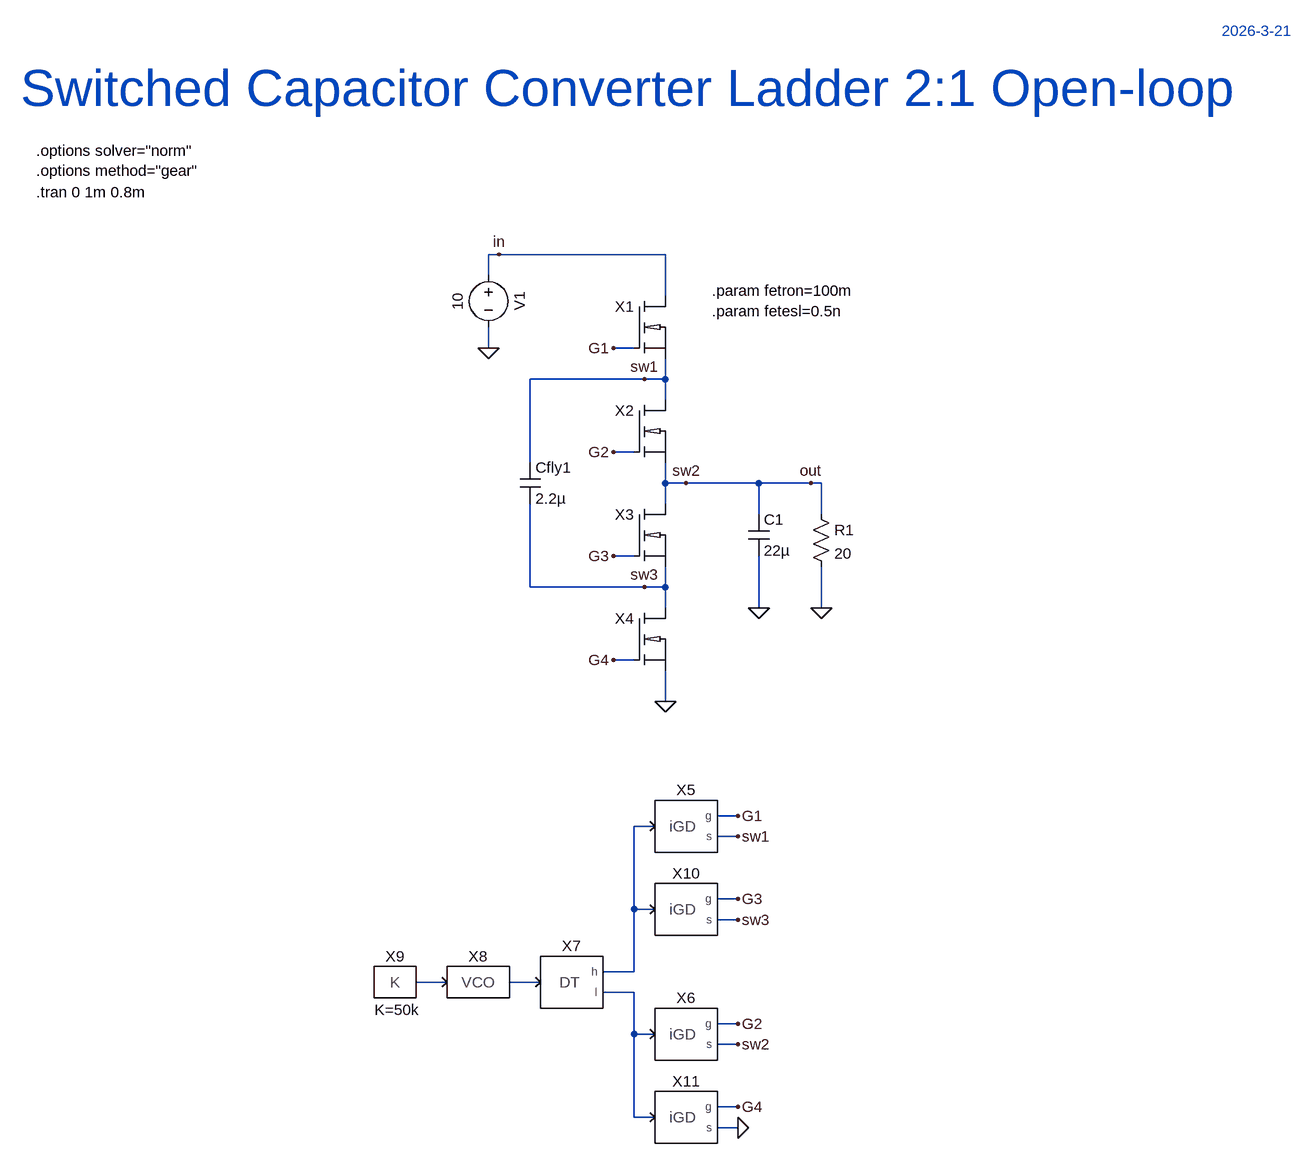
[diagram p0: schematic SCC_Ladder_2to1_openloop.asc]
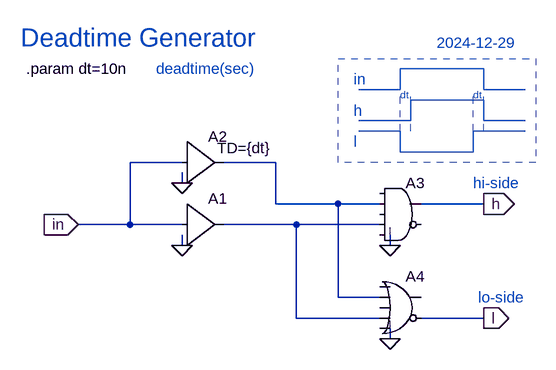
[diagram p1: sub-circuit deadtime.asc]
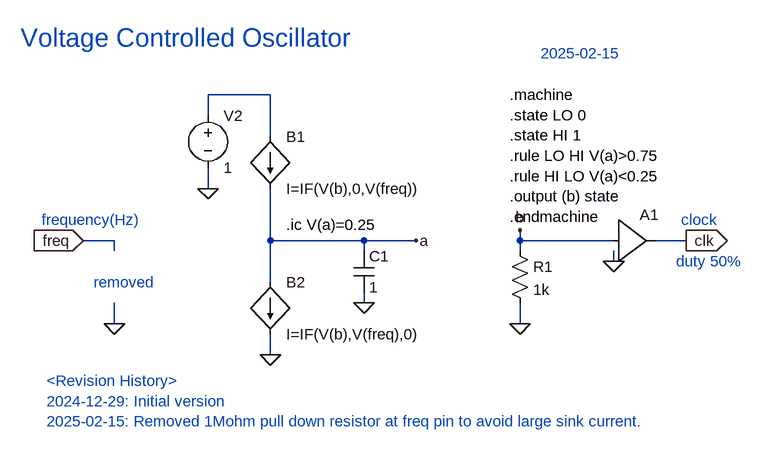
[diagram p2: sub-circuit vco.asc]
SCC_Ladder_2to1_openloop.asc, the LTspice schematic file:
Version 4.1
SHEET 1 2724 2028
WIRE 176 592 160 592
WIRE 432 592 176 592
WIRE 160 624 160 592
WIRE 432 656 432 592
WIRE 160 736 160 704
WIRE 384 736 352 736
WIRE 400 784 224 784
WIRE 432 784 432 752
WIRE 432 784 400 784
WIRE 432 816 432 784
WIRE 384 896 352 896
WIRE 224 912 224 784
WIRE 432 944 432 912
WIRE 464 944 432 944
WIRE 576 944 464 944
WIRE 656 944 576 944
WIRE 672 944 656 944
WIRE 432 976 432 944
WIRE 576 992 576 944
WIRE 672 992 672 944
WIRE 384 1056 352 1056
WIRE 224 1104 224 976
WIRE 400 1104 224 1104
WIRE 432 1104 432 1072
WIRE 432 1104 400 1104
WIRE 432 1136 432 1104
WIRE 576 1136 576 1056
WIRE 672 1136 672 1072
WIRE 384 1216 352 1216
WIRE 432 1280 432 1232
WIRE 544 1456 512 1456
WIRE 416 1472 384 1472
WIRE 544 1488 512 1488
WIRE 544 1584 512 1584
WIRE 384 1600 384 1472
WIRE 416 1600 384 1600
WIRE 544 1616 512 1616
WIRE 384 1696 384 1600
WIRE 384 1696 336 1696
WIRE 96 1712 48 1712
WIRE 240 1712 192 1712
WIRE 384 1728 336 1728
WIRE 544 1776 512 1776
WIRE 384 1792 384 1728
WIRE 416 1792 384 1792
WIRE 544 1808 512 1808
WIRE 544 1904 512 1904
WIRE 384 1920 384 1792
WIRE 416 1920 384 1920
WIRE 544 1936 512 1936
FLAG 576 1136 0
FLAG 656 944 out
FLAG 176 592 in
FLAG 464 944 sw2
FLAG 672 1136 0
FLAG 432 1280 0
FLAG 352 736 G1
FLAG 352 896 G2
FLAG 352 1056 G3
FLAG 352 1216 G4
FLAG 400 784 sw1
FLAG 400 1104 sw3
FLAG 544 1456 G1
FLAG 544 1488 sw1
FLAG 544 1776 G2
FLAG 544 1584 G3
FLAG 544 1616 sw3
FLAG 544 1904 G4
FLAG 544 1936 0
FLAG 544 1808 sw2
FLAG 160 736 0
SYMBOL voltage 160 608 R0
WINDOW 0 32 56 VTop 2
WINDOW 3 -32 56 VBottom 2
WINDOW 123 0 0 Left 0
WINDOW 39 0 0 Left 0
SYMATTR InstName V1
SYMATTR Value 10
SYMBOL cap 560 992 R0
SYMATTR InstName C1
SYMATTR Value 22µ
SYMATTR SpiceLine Rser=3m Lser=0.9n
SYMBOL res 656 976 R0
SYMATTR InstName R1
SYMATTR Value 20
SYMBOL iNMOS 432 864 R0
SYMATTR InstName X2
SYMATTR Value esl={fetesl} rsnb=1k csnb=10p
SYMATTR SpiceLine ron={fetron}
SYMBOL iNMOS 432 1024 R0
SYMATTR InstName X3
SYMATTR Value esl={fetesl} rsnb=1k csnb=10p
SYMATTR SpiceLine ron={fetron}
SYMBOL iNMOS 432 704 R0
SYMATTR InstName X1
SYMATTR Value esl={fetesl} rsnb=1k csnb=10p
SYMATTR SpiceLine ron={fetron}
SYMBOL iNMOS 432 1184 R0
SYMATTR InstName X4
SYMATTR Value esl={fetesl} rsnb=1k csnb=10p
SYMATTR SpiceLine ron={fetron}
SYMBOL cap 208 912 R0
SYMATTR InstName Cfly1
SYMATTR Value 2.2µ
SYMATTR SpiceLine Rser=5m Lser=0.7n
SYMBOL iGD 464 1472 R0
SYMATTR InstName X5
SYMBOL iGD 464 1792 R0
SYMATTR InstName X6
SYMBOL DEADTIME 288 1712 R0
SYMATTR InstName X7
SYMBOL PowerSim\\VCO 144 1712 R0
SYMATTR InstName X8
SYMBOL PowerSim\\CONST 16 1712 R0
WINDOW 39 3 58 Bottom 2
SYMATTR SpiceLine K=50k
SYMATTR InstName X9
SYMBOL iGD 464 1600 R0
SYMATTR InstName X10
SYMBOL iGD 464 1920 R0
SYMATTR InstName X11
TEXT -536 496 Left 2 !.tran 0 1m 0.8m
TEXT -560 336 Left 6 ;Switched Capacitor Converter Ladder 2:1 Open-loop
TEXT 1288 248 Left 2 ;2026-3-21
TEXT -536 432 Left 2 !.options solver="norm"\n.options method="gear"
TEXT 504 648 Left 2 !.param fetron=100m\n.param fetesl=0.5n

deadtime.asc, the sub-circuit schematic file:
Version 4
SHEET 1 1412 1312
WIRE 64 288 -16 288
WIRE 208 288 128 288
WIRE 64 320 64 304
WIRE 208 352 208 288
WIRE 304 352 208 352
WIRE 368 352 304 352
WIRE 528 352 432 352
WIRE -16 384 -16 288
WIRE -16 384 -96 384
WIRE 64 384 -16 384
WIRE 240 384 128 384
WIRE 368 384 240 384
WIRE 64 416 64 400
WIRE 384 416 384 400
WIRE 304 496 304 352
WIRE 368 496 304 496
WIRE 240 528 240 384
WIRE 368 528 240 528
WIRE 528 528 432 528
WIRE 384 560 384 544
FLAG -96 384 in
IOPIN -96 384 In
FLAG 64 416 0
FLAG 64 320 0
FLAG 384 416 0
FLAG 384 560 0
FLAG 528 352 h
IOPIN 528 352 Out
FLAG 528 528 l
IOPIN 528 528 Out
SYMBOL Digital\\buf1 64 320 R0
SYMATTR InstName A1
SYMBOL Digital\\buf1 64 224 R0
WINDOW 3 54 42 Left 2
SYMATTR Value TD={dt}
SYMATTR InstName A2
SYMBOL Digital\\and 400 304 R0
SYMATTR InstName A3
SYMBOL Digital\\or 400 448 R0
SYMATTR InstName A4
TEXT -176 144 Left 2 !.param dt=10n
TEXT -184 96 Left 4 ;Deadtime Generator
TEXT 24 144 Left 2 ;deadtime(sec)
TEXT 512 320 Left 2 ;hi-side
TEXT 520 496 Left 2 ;lo-side
TEXT 328 160 Left 2 ;in
TEXT 328 208 Left 2 ;h
TEXT 328 256 Left 2 ;l
TEXT 400 184 Left 1 ;dt
TEXT 512 184 Left 1 ;dt
TEXT 456 104 Left 2 ;2024-12-29
LINE Normal 400 176 336 176
LINE Normal 400 176 400 144
LINE Normal 528 144 400 144
LINE Normal 528 176 528 144
LINE Normal 592 176 528 176
LINE Normal 416 224 336 224
LINE Normal 416 224 416 192
LINE Normal 528 192 416 192
LINE Normal 528 224 528 192
LINE Normal 592 224 528 224
LINE Normal 400 240 336 240
LINE Normal 400 272 400 240
LINE Normal 512 272 400 272
LINE Normal 512 272 512 240
LINE Normal 592 240 512 240
LINE Normal 400 240 400 176 2
LINE Normal 512 240 512 176 2
LINE Normal 416 240 416 176 2
LINE Normal 528 240 528 176 2
RECTANGLE Normal 608 288 304 128 2

vco.asc, the sub-circuit schematic file:
Version 4
SHEET 1 1132 680
WIRE 176 -176 80 -176
WIRE 80 -144 80 -176
WIRE 176 -112 176 -176
WIRE 80 -32 80 -64
WIRE -64 48 -112 48
WIRE 176 48 176 -32
WIRE 320 48 176 48
WIRE 400 48 320 48
WIRE 560 48 560 32
WIRE 704 48 560 48
WIRE 816 48 768 48
WIRE -64 64 -64 48
WIRE 320 64 320 48
WIRE 560 64 560 48
WIRE 704 80 704 64
WIRE 176 112 176 48
WIRE 320 144 320 128
WIRE -64 176 -64 144
WIRE 560 176 560 144
WIRE 176 224 176 192
FLAG 320 144 0
FLAG 560 176 0
FLAG 176 224 0
FLAG 80 -32 0
FLAG 400 48 a
FLAG 560 32 b
FLAG 704 80 0
FLAG 816 48 clk
IOPIN 816 48 Out
FLAG -112 48 freq
IOPIN -112 48 In
FLAG -64 176 0
SYMBOL cap 304 64 R0
SYMATTR InstName C1
SYMATTR Value 1
SYMBOL res 544 48 R0
SYMATTR InstName R1
SYMATTR Value 1k
SYMBOL voltage 80 -160 R0
WINDOW 123 0 0 Left 0
WINDOW 39 0 0 Left 0
SYMATTR InstName V2
SYMATTR Value 1
SYMBOL bi 176 112 R0
SYMATTR InstName B2
SYMATTR Value I=IF(V(b),V(freq),0)
SYMBOL bi 176 -112 R0
SYMATTR InstName B1
SYMATTR Value I=IF(V(b),0,V(freq))
SYMBOL Digital\\buf1 704 -16 R0
SYMATTR InstName A1
TEXT 544 -176 Left 2 !.machine\n.state LO 0\n.state HI 1\n.rule LO HI V(a)>0.75\n.rule HI LO V(a)<0.25\n.output (b) state\n.endmachine
TEXT 200 24 Left 2 !.ic V(a)=0.25
TEXT -208 -264 Left 4 ;Voltage Controlled Oscillator
TEXT -176 16 Left 2 ;frequency(Hz)
TEXT 808 16 Left 2 ;clock
TEXT 800 80 Left 2 ;duty 50%
TEXT 592 -240 Left 2 ;2025-02-15
TEXT -168 264 Left 2 ;<Revision History>\n2024-12-29: Initial version\n2025-02-15: Removed 1Mohm pull down resistor at freq pin to avoid large sink current.
TEXT -96 112 Left 2 ;removed

The netlist it stands for:
* SCC_Ladder_2to1_openloop.asc
V1 in 0 10
C1 sw2 0 22µ Rser=3m Lser=0.9n
R1 sw2 0 20
X§X2 sw1 G2 sw2 iNMOS params: esl={fetesl} rsnb=1k csnb=10p ron={fetron}  ; pins D G S
X§X3 sw2 G3 sw3 iNMOS params: esl={fetesl} rsnb=1k csnb=10p ron={fetron}  ; pins D G S
X§X1 in G1 sw1 iNMOS params: esl={fetesl} rsnb=1k csnb=10p ron={fetron}  ; pins D G S
X§X4 sw3 G4 0 iNMOS params: esl={fetesl} rsnb=1k csnb=10p ron={fetron}  ; pins D G S
Cfly1 sw1 sw3 2.2µ Rser=5m Lser=0.7n
X§X5 N001 G1 sw1 iGD  ; pins in g s
X§X6 N004 G2 sw2 iGD  ; pins in g s
X§X7 N003 N004 N001 deadtime params: dt=10n
X§X8 N002 N003 vco
X§X9 N002 CONST K=50k  ; pins K
X§X10 N001 G3 sw3 iGD  ; pins in g s
X§X11 N004 G4 0 iGD  ; pins in g s

* block symbol definitions
.subckt deadtime in l h
A1 in 0 0 0 0 0 N002 0 BUF
A2 in 0 0 0 0 0 N001 0 BUF TD={dt}
A3 0 N001 0 N002 0 0 h 0 AND
A4 0 N001 0 N002 0 l 0 0 OR
.param dt=10n
* Deadtime Generator
* deadtime(sec)
* hi-side
* lo-side
* in
* h
* l
* dt
* dt
* 2024-12-29
.ends deadtime

.subckt vco freq clk
C1 a 0 1
R1 b 0 1k
V2 N001 0 1
B2 a 0 I=IF(V(b),V(freq),0)
B1 N001 a I=IF(V(b),0,V(freq))
A1 b 0 0 0 0 0 clk 0 BUF
.machine
.state LO 0
.state HI 1
.rule LO HI V(a)>0.75
.rule HI LO V(a)<0.25
.output (b) state
.endmachine
.ic V(a)=0.25
* Voltage Controlled Oscillator
* frequency(Hz)
* clock
* duty 50%
* 2025-02-15
* <Revision History>
* 2024-12-29: Initial version
* 2025-02-15: Removed 1Mohm pull down resistor at freq pin to avoid large sink current.
* removed
.ends vco

.tran 0 1m 0.8m
* Switched Capacitor Converter Ladder 2:1 Open-loop
* 2026-3-21
.options solver="norm"
.options method="gear"
.param fetron=100m
.param fetesl=0.5n
.backanno
.end